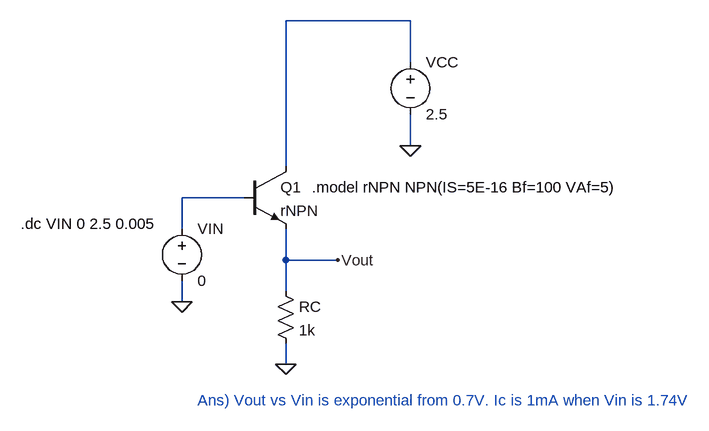
[diagram p0: schematic 4_58.asc]
4_58.asc, the LTspice schematic file:
Version 4
SHEET 1 880 680
WIRE 336 -96 144 -96
WIRE 336 -32 336 -96
WIRE 336 96 336 48
WIRE 144 128 144 -96
WIRE 80 176 -16 176
WIRE -16 224 -16 176
WIRE 144 272 144 224
WIRE 224 272 144 272
WIRE 144 320 144 272
WIRE -16 336 -16 304
WIRE 144 432 144 400
FLAG -16 336 0
FLAG 336 96 0
FLAG 224 272 Vout
FLAG 144 432 0
SYMBOL npn 80 128 R0
SYMATTR InstName Q1
SYMATTR Value rNPN
SYMBOL voltage -16 208 R0
SYMATTR InstName VIN
SYMATTR Value 0
SYMBOL voltage 336 -48 R0
SYMATTR InstName VCC
SYMATTR Value 2.5
SYMBOL res 128 304 R0
SYMATTR InstName RC
SYMATTR Value 1k
TEXT 184 160 Left 2 !.model rNPN NPN(IS=5E-16 Bf=100 VAf=5)
TEXT -264 216 Left 2 !.dc VIN 0 2.5 0.005
TEXT 8 488 Left 2 ;Ans) Vout vs Vin is exponential from 0.7V. Ic is 1mA when Vin is 1.74V

The netlist it stands for:
* 4_58.asc
Q1 N001 N002 Vout 0 rNPN
VIN N002 0 0
VCC N001 0 2.5
RC Vout 0 1k
.model NPN NPN
.model PNP PNP
.lib standard.bjt
.model rNPN NPN(IS=5E-16 Bf=100 VAf=5)
.dc VIN 0 2.5 0.005
* Ans) Vout vs Vin is exponential from 0.7V. Ic is 1mA when Vin is 1.74V
.backanno
.end

* Results of the author's LTspice run, read from the files saved beside the schematic
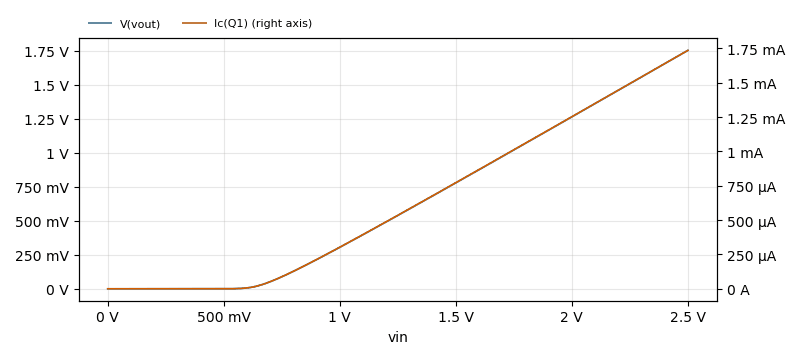
[diagram p1: DC transfer characteristic of 4_58.asc, plotted from the saved traces]
* DC transfer characteristic, 1 run:
*   V(vout): 750 fV at vin=0 V, 1.753 V at vin=2.5 V, min 750 fV, max 1.753 V
*   Ic(Q1): 2.501 pA at vin=0 V, 1.736 mA at vin=2.5 V, min 2.435 pA, max 1.736 mA